# Altium schematic sheet Power.SchDoc
size A4; SheetNumber: 1; SheetTotal: 3
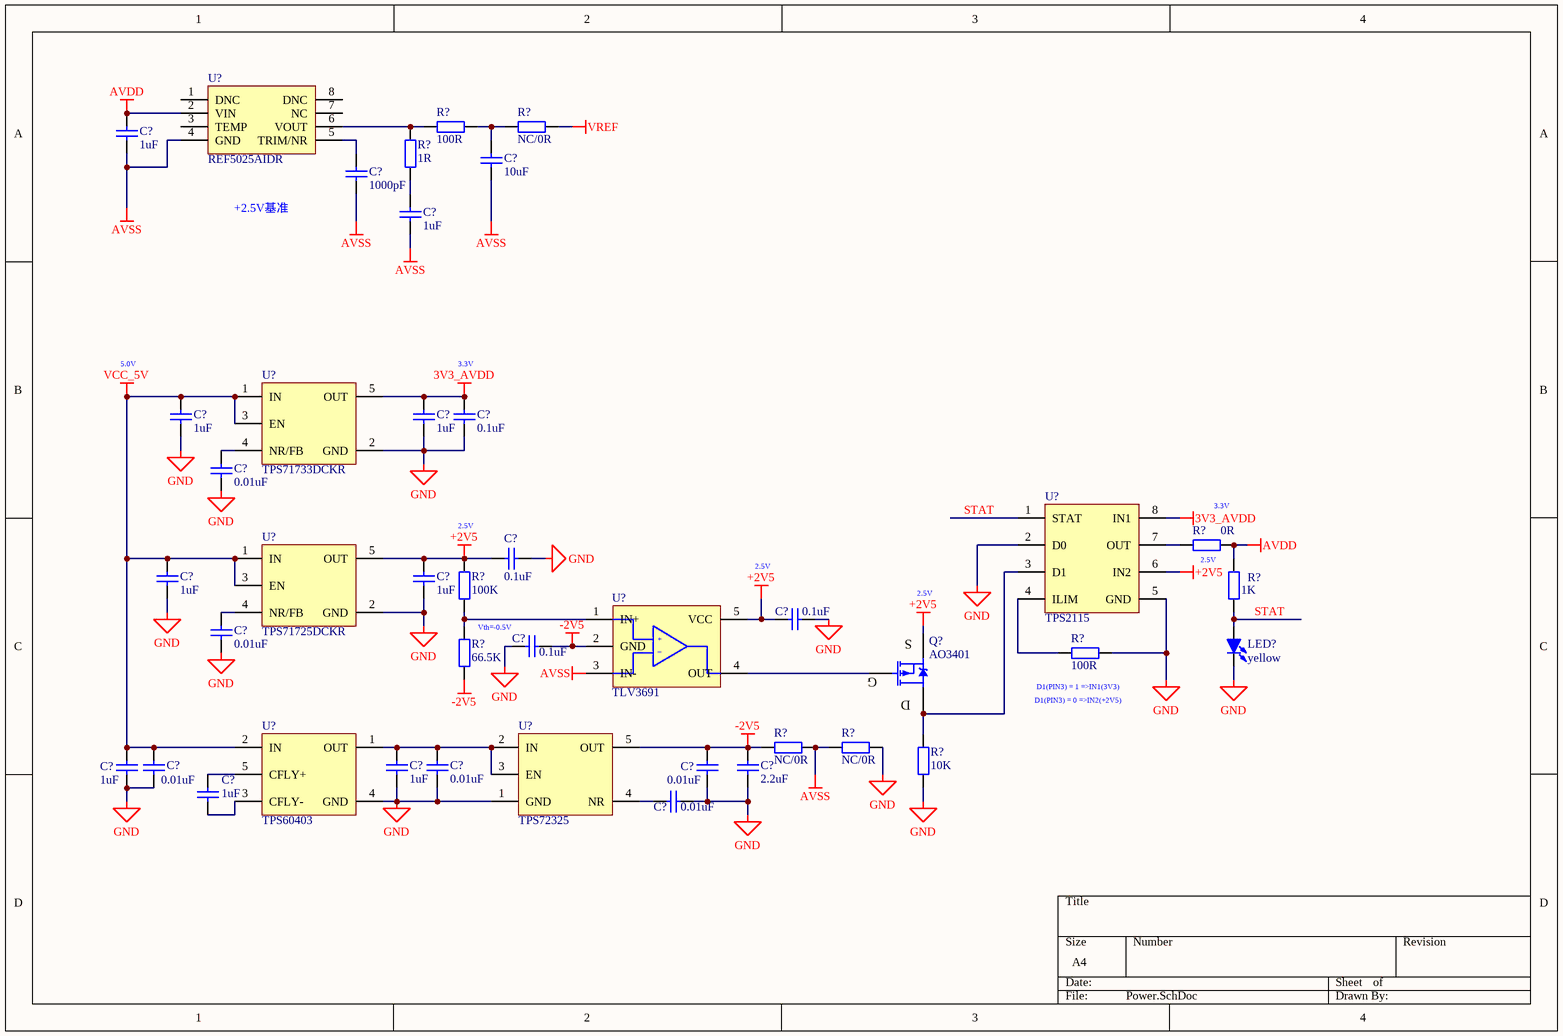
[diagram p0: Power.SchDoc]

## Parts
(Parts that share a designator on the sheet are numbered #1, #2 ... from top to bottom, then left to right.)
C?#1  1uF  [C0402_L]
C?#2  10uF  [C0603_L]
C?#3  1000pF  [C0603_L]
C?#4  1uF  [C0402_L]
C?#5  1uF  [C0402_L]
C?#6  1uF  [C0402_L]
C?#7  0.1uF  [C0402_L]
C?#8  0.01uF  [C0402_L]
C?#9  0.1uF  [C0402_L]
C?#10  1uF  [C0402_L]
C?#11  1uF  [C0402_L]
C?#12  0.1uF  [C0402_L]
C?#13  0.01uF  [C0402_L]
C?#14  0.1uF  [C0402_L]
C?#15  1uF  [C0402_L]
C?#16  0.01uF  [C0402_L]
C?#17  1uF  [C0402_L]
C?#18  0.01uF  [C0402_L]
C?#19  0.01uF  [C0402_L]
C?#20  2.2uF  [C0402_L]
C?#21  1uF  [C0402_L]
C?#22  0.01uF  [C0402_L]
LED?  yellow  [LED0402]
Q?  AO3401  [SOT23-3N]
R?#1  100R  [R0402_L]
R?#2  NC/0R  [R0402_L]
R?#3  1R  [R0402_L]
R?#4  0R  [R0402_L]
R?#5  100K  [R0402_L]
R?#6  1K  [R0402_L]
R?#7  100R  [R0402_L]
R?#8  66.5K  [R0402_L]
R?#9  NC/0R  [R0402_L]
R?#10  NC/0R  [R0402_L]
R?#11  10K  [R0402_L]
U?#1  REF5025AIDR  [SOIC-8L]
U?#2  TPS71733DCKR  [SC70-5]
U?#3  TPS2115  [TSSOP-8]
U?#4  TPS71725DCKR  [SC70-5]
U?#5  TLV3691  [SC70-5]
U?#6  TPS60403  [SOT23-5L]
U?#7  TPS72325  [SOT23-5L]

## Nets
3V3_AVDD: C?#6.2 C?#7.2 U?#2.5(OUT) U?#3.8(IN1)
+2V5: C?#9.1 C?#11.2 C?#12.2 Q?.2(S) R?#5.2 U?#3.6(IN2) U?#4.5(OUT) U?#5.5(VCC)
-2V5: C?#14.1 C?#19.2 C?#20.2 R?#8.1 R?#9.1 U?#5.2(GND) U?#7.5(OUT)
AVDD: C?#1.2 R?#4.1 R?#6.2 U?#1.2(VIN)
AVSS: C?#1.1 C?#2.1 C?#3.1 C?#4.1 R?#9.2 R?#10.1 U?#1.4(GND) U?#5.3(IN-)
GND: C?#5.1 C?#6.1 C?#7.1 C?#8.1 C?#9.2 C?#10.1 C?#11.1 C?#12.1 C?#13.1 C?#14.2 C?#15.1 C?#16.1 C?#17.1 C?#18.1 C?#19.1 C?#20.1 C?#22.1 LED?.2(K) R?#7.2 R?#10.2 R?#11.1 U?#2.2(GND) U?#3.2(D0) U?#3.5(GND) U?#4.2(GND) U?#6.4(GND) U?#7.1(GND)
VCC_5V: C?#5.2 C?#10.2 C?#15.2 C?#16.2 U?#2.1(IN) U?#2.3(EN) U?#4.1(IN) U?#4.3(EN) U?#6.2(IN)
VREF: R?#2.2
STAT: LED?.1(A) R?#6.1 U?#3.1(STAT)
NetC?#2_2: C?#2.2 R?#1.2 R?#2.1
NetC?#3_2: C?#3.2 U?#1.5(TRIM/NR)
NetC?#4_2: C?#4.2 R?#3.1
NetC?#8_2: C?#8.2 U?#2.4(NR/FB)
NetC?#13_2: C?#13.2 U?#4.4(NR/FB)
NetC?#17_2: C?#17.2 C?#18.2 U?#6.1(OUT) U?#7.2(IN) U?#7.3(EN)
NetC?#21_1: C?#21.1 U?#6.3(CFLY-)
NetC?#21_2: C?#21.2 U?#6.5(CFLY+)
NetC?#22_2: C?#22.2 U?#7.4(NR)
NetQ?_1: Q?.1(G) U?#5.4(OUT)
NetQ?_3: Q?.3(D) R?#11.2 U?#3.3(D1)
NetR?#1_1: R?#1.1 R?#3.2 U?#1.6(VOUT)
NetR?#4_2: R?#4.2 U?#3.7(OUT)
NetR?#5_1: R?#5.1 R?#8.2 U?#5.1(IN+)
NetR?#7_1: R?#7.1 U?#3.4(ILIM)

Not connected (* = marked no-connect by the designer): U?#1 1(DNC) 3(TEMP) 7(NC) 8(DNC)

## Notes on the sheet
- +2.5V基准
- 5.0V
- (near C?#7) 3.3V
- (near R?#4) 3.3V
- 2.5V
- (near R?#4) 2.5V
- Vth=-0.5V
- (near R?#7) D1(PIN3) = 1 =>IN1(3V3)
- (near R?#7) D1(PIN3) = 0 =>IN2(+2V5)
- (in symbol TLV3691) +; _

## Library data of the parts
C?#1-C?#22 = C: 贴片电容; BOM名称: 无极性贴片电容; 联系卖家，免费查找封装: 唯一出售店铺网址https://shop463601444.taobao.com
LED? = LED-SMD: 贴片LED; 联系卖家 免费查找封装: 封装库来自淘宝卖家ID：黄晶宝石; BOM名称: 贴片LED
Q? = AO3401: P沟道 30V/4.2A; BOM名称: 场效应管; 联系卖家，免费查找封装: 唯一出售店铺网址https://shop463601444.taobao.com; 参数: P沟道 30V/4.2A
R?#1-R?#11 = R: 贴片电阻; 联系卖家，免费查找封装: 唯一出售店铺网址https://shop463601444.taobao.com; BOM名称: 贴片电阻
U?#1 = REF5025AIDR: 3uVpp/V噪声 3ppm/℃漂移 电压基准 0.05%
U?#2 U?#4 = TPS717xx
U?#3 = TPS2115: 2.8~5.5V 84mR 1.25A 电源多路复用器
U?#5 = TLV3691: 毫微功耗比较器
U?#6 = TPS6040x: 非稳压60mA电荷泵电压逆变器
U?#7 = TPS723xx